# EAGLE design PCB-CARR-SL20 (EAGLE 7.5.0)
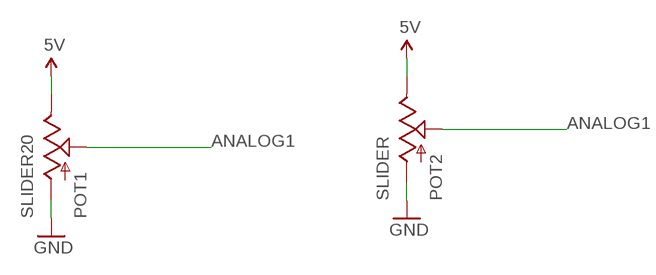
[diagram p0: schematic, sheet 1]

## Parts
POT1  SLIDER20  [SLIDER20]
POT2  SLIDER  [SLIDER20-CAR1]

## Nets
5V [Power]: POT1.1(E) POT2.1(E)
ANALOG1: POT1.2A(S) POT2.2A(S)
GND [Power]: POT1.3(A) POT2.3(A)

## Library data of the parts
POT1 POT2 = SKAARHOJ:SLIDER

## Net classes
0 default: width 0.203 mm, drill 0.406 mm, clearance 0.152 mm
1 Power: width 0.406 mm, drill 0.61 mm, clearance 0.203 mm
2 Signal: width 0.152 mm, clearance 0.152 mm

## Board
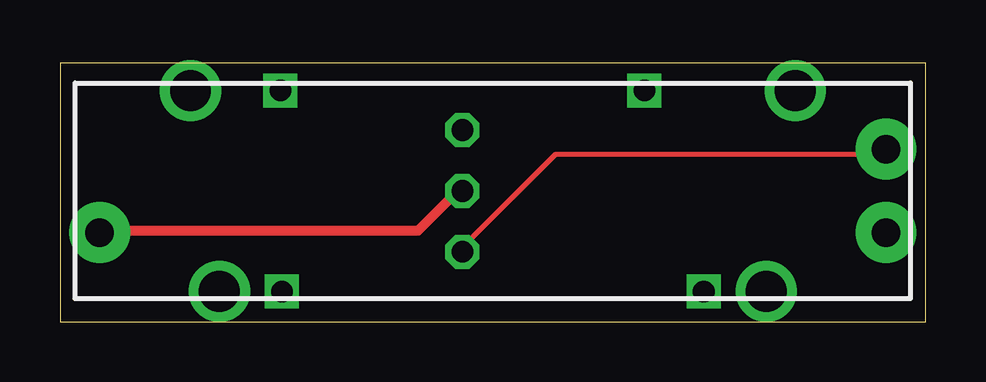
[diagram p1: board, top side]
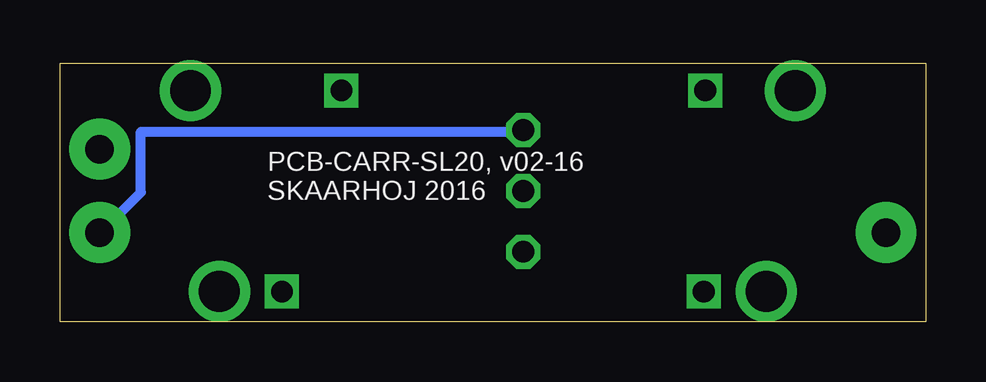
[diagram p2: board, bottom side, seen from below]

Size 36.07 x 10.79 mm. Coordinates in mm from the lower left corner, seen from the top.
Outline: 0,0 36.07,0 36.07,10.79 0,10.79 0,0
Copper layers (1*16): Top 0.035mm / dielectric 1.5mm / Bottom 0.035mm
Design rules "Fusion_eagle_rule_v1.1": minimum track width 6mil, minimum drill 12mil, track to track 6mil, track to pad 6mil, pad to pad 6mil, via to via 6mil, smd to smd 0mil, copper to edge 10mil, drill to drill 10mil, minimum pad ring 10mil, minimum via ring 6mil, stop-mask expansion 2mil, vias tented up to drill 100mil, thermal gap 10mil

### Footprints (pad centres in the part's own frame; a part is rotated, then mirrored left to right if it is on the bottom)
SLIDER20 = drill 1.194 pad 2.54: 1 -16.383,1.74; 2A -16.383,-1.74; 3 16.383,1.74 | drill 1.702: P$1 -11.392,4.191; P$2 11.392,4.191; P$3 12.598,-4.191; P$4 -12.598,-4.191
SLIDER20-CAR1 = drill 0.9 octagon: 1 -1.27,2.54; 2A -1.27,-2.54; 3 -1.27,0 | drill 0.9 square: P$1 -8.852,4.191; P$2 6.312,4.191; P$3 8.788,-4.191; P$4 -8.788,-4.191

### Placement (x,y rotation side)
POT1  18.03,5.46 180 top
POT2  18.03,5.46 0 top

### Tracks (layer width: path | path; a pad name or v marks a point on that pad's centre or on a via)
5V
  Bottom 0.406: POT2.1 16.83,7.94 32.7,7.94 32.7,5.4 34.29,3.81 POT1.1
ANALOG1
  Top 0.203: POT2.2A 16.83,3.17 20.64,6.99 34.29,6.99 POT1.2A
GND
  Top 0.406: POT2.3 16.51,5.4 14.92,3.81 1.91,3.81 POT1.3

### Text on the board
_bsilk: PCB-CARR-SL20, v02-16 / SKAARHOJ 2016